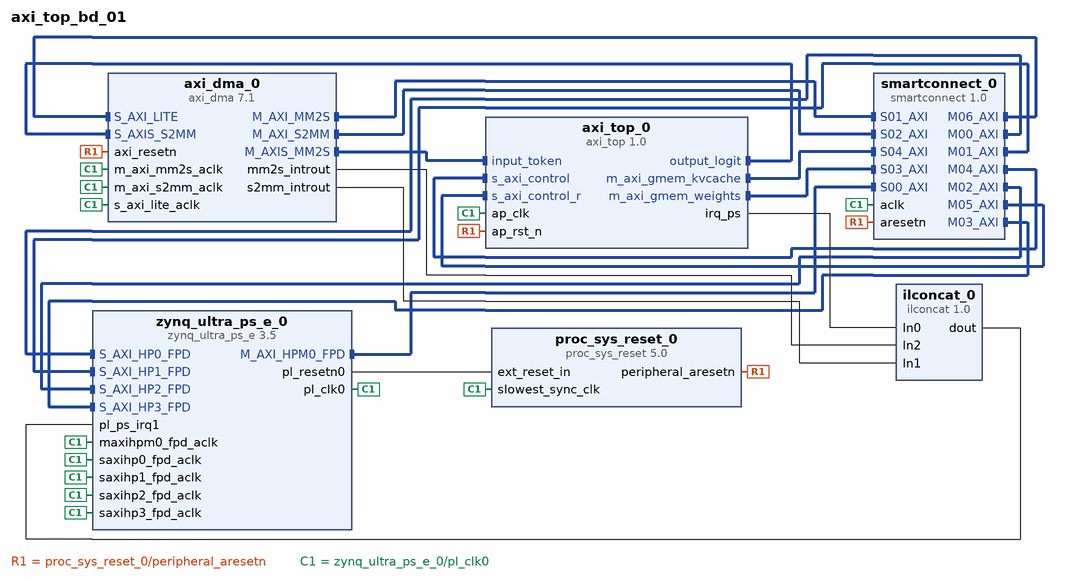
[diagram p0: block diagram of the top level]
# Vivado block design axi_top_bd_01, xck26-sfvc784-2LV-c, Vivado 2025.1
create_bd_design axi_top_bd_01

create_bd_cell -type ip -vlnv xilinx.com:ip:zynq_ultra_ps_e:3.5 zynq_ultra_ps_e_0
set_property -dict [list \
  CONFIG.CAN0_BOARD_INTERFACE custom \
  CONFIG.CAN1_BOARD_INTERFACE custom \
  CONFIG.CSU_BOARD_INTERFACE custom \
  CONFIG.DP_BOARD_INTERFACE custom \
  CONFIG.GEM0_BOARD_INTERFACE custom \
  CONFIG.GEM1_BOARD_INTERFACE custom \
  CONFIG.GEM2_BOARD_INTERFACE custom \
  CONFIG.GEM3_BOARD_INTERFACE custom \
  CONFIG.GPIO_BOARD_INTERFACE custom \
  CONFIG.IIC0_BOARD_INTERFACE custom \
  CONFIG.IIC1_BOARD_INTERFACE custom \
  CONFIG.NAND_BOARD_INTERFACE custom \
  CONFIG.PCIE_BOARD_INTERFACE custom \
  CONFIG.PJTAG_BOARD_INTERFACE custom \
  CONFIG.PMU_BOARD_INTERFACE custom \
  CONFIG.PSU_BANK_0_IO_STANDARD LVCMOS18 \
  CONFIG.PSU_BANK_1_IO_STANDARD LVCMOS18 \
  CONFIG.PSU_BANK_2_IO_STANDARD LVCMOS18 \
  CONFIG.PSU_BANK_3_IO_STANDARD LVCMOS18 \
  CONFIG.PSU_USB3__DUAL_CLOCK_ENABLE 0 \
  CONFIG.PSU__CAN1__PERIPHERAL__ENABLE 0 \
  CONFIG.PSU__CRF_APB__ACPU_CTRL__FREQMHZ 1333.333 \
  CONFIG.PSU__CRF_APB__ACPU_CTRL__SRCSEL APLL \
  CONFIG.PSU__CRF_APB__APLL_CTRL__SRCSEL PSS_REF_CLK \
  CONFIG.PSU__CRF_APB__APLL_FRAC_CFG__ENABLED 1 \
  CONFIG.PSU__CRF_APB__DBG_FPD_CTRL__FREQMHZ 250 \
  CONFIG.PSU__CRF_APB__DBG_FPD_CTRL__SRCSEL IOPLL \
  CONFIG.PSU__CRF_APB__DBG_TRACE_CTRL__FREQMHZ 250 \
  CONFIG.PSU__CRF_APB__DBG_TRACE_CTRL__SRCSEL IOPLL \
  CONFIG.PSU__CRF_APB__DBG_TSTMP_CTRL__FREQMHZ 250 \
  CONFIG.PSU__CRF_APB__DBG_TSTMP_CTRL__SRCSEL IOPLL \
  CONFIG.PSU__CRF_APB__DDR_CTRL__FREQMHZ 1200 \
  CONFIG.PSU__CRF_APB__DDR_CTRL__SRCSEL DPLL \
  CONFIG.PSU__CRF_APB__DPDMA_REF_CTRL__FREQMHZ 600 \
  CONFIG.PSU__CRF_APB__DPDMA_REF_CTRL__SRCSEL APLL \
  CONFIG.PSU__CRF_APB__DPLL_CTRL__SRCSEL PSS_REF_CLK \
  CONFIG.PSU__CRF_APB__DP_AUDIO_REF_CTRL__SRCSEL VPLL \
  CONFIG.PSU__CRF_APB__DP_STC_REF_CTRL__SRCSEL VPLL \
  CONFIG.PSU__CRF_APB__DP_VIDEO_REF_CTRL__SRCSEL DPLL \
  CONFIG.PSU__CRF_APB__GDMA_REF_CTRL__FREQMHZ 600 \
  CONFIG.PSU__CRF_APB__GDMA_REF_CTRL__SRCSEL DPLL \
  CONFIG.PSU__CRF_APB__GPU_REF_CTRL__FREQMHZ 600 \
  CONFIG.PSU__CRF_APB__GPU_REF_CTRL__SRCSEL IOPLL \
  CONFIG.PSU__CRF_APB__TOPSW_LSBUS_CTRL__FREQMHZ 100 \
  CONFIG.PSU__CRF_APB__TOPSW_LSBUS_CTRL__SRCSEL IOPLL \
  CONFIG.PSU__CRF_APB__TOPSW_MAIN_CTRL__FREQMHZ 533.33 \
  CONFIG.PSU__CRF_APB__TOPSW_MAIN_CTRL__SRCSEL DPLL \
  CONFIG.PSU__CRF_APB__VPLL_CTRL__SRCSEL PSS_REF_CLK \
  CONFIG.PSU__CRL_APB__ADMA_REF_CTRL__FREQMHZ 500 \
  CONFIG.PSU__CRL_APB__ADMA_REF_CTRL__SRCSEL IOPLL \
  CONFIG.PSU__CRL_APB__CAN1_REF_CTRL__FREQMHZ 100 \
  CONFIG.PSU__CRL_APB__CAN1_REF_CTRL__SRCSEL IOPLL \
  CONFIG.PSU__CRL_APB__CPU_R5_CTRL__FREQMHZ 533.333 \
  CONFIG.PSU__CRL_APB__CPU_R5_CTRL__SRCSEL RPLL \
  CONFIG.PSU__CRL_APB__DBG_LPD_CTRL__FREQMHZ 250 \
  CONFIG.PSU__CRL_APB__DBG_LPD_CTRL__SRCSEL IOPLL \
  CONFIG.PSU__CRL_APB__GEM3_REF_CTRL__FREQMHZ 125 \
  CONFIG.PSU__CRL_APB__GEM3_REF_CTRL__SRCSEL IOPLL \
  CONFIG.PSU__CRL_APB__I2C0_REF_CTRL__FREQMHZ 100 \
  CONFIG.PSU__CRL_APB__I2C0_REF_CTRL__SRCSEL IOPLL \
  CONFIG.PSU__CRL_APB__I2C1_REF_CTRL__FREQMHZ 100 \
  CONFIG.PSU__CRL_APB__I2C1_REF_CTRL__SRCSEL IOPLL \
  CONFIG.PSU__CRL_APB__IOPLL_CTRL__SRCSEL PSS_REF_CLK \
  CONFIG.PSU__CRL_APB__IOU_SWITCH_CTRL__FREQMHZ 250 \
  CONFIG.PSU__CRL_APB__IOU_SWITCH_CTRL__SRCSEL IOPLL \
  CONFIG.PSU__CRL_APB__LPD_LSBUS_CTRL__FREQMHZ 100 \
  CONFIG.PSU__CRL_APB__LPD_LSBUS_CTRL__SRCSEL IOPLL \
  CONFIG.PSU__CRL_APB__LPD_SWITCH_CTRL__FREQMHZ 500 \
  CONFIG.PSU__CRL_APB__LPD_SWITCH_CTRL__SRCSEL IOPLL \
  CONFIG.PSU__CRL_APB__PCAP_CTRL__FREQMHZ 200 \
  CONFIG.PSU__CRL_APB__PCAP_CTRL__SRCSEL IOPLL \
  CONFIG.PSU__CRL_APB__PL0_REF_CTRL__FREQMHZ 100 \
  CONFIG.PSU__CRL_APB__PL0_REF_CTRL__SRCSEL IOPLL \
  CONFIG.PSU__CRL_APB__PL1_REF_CTRL__SRCSEL IOPLL \
  CONFIG.PSU__CRL_APB__QSPI_REF_CTRL__FREQMHZ 125 \
  CONFIG.PSU__CRL_APB__QSPI_REF_CTRL__SRCSEL IOPLL \
  CONFIG.PSU__CRL_APB__RPLL_CTRL__SRCSEL PSS_REF_CLK \
  CONFIG.PSU__CRL_APB__SDIO1_REF_CTRL__FREQMHZ 200 \
  CONFIG.PSU__CRL_APB__SDIO1_REF_CTRL__SRCSEL RPLL \
  CONFIG.PSU__CRL_APB__SPI1_REF_CTRL__SRCSEL IOPLL \
  CONFIG.PSU__CRL_APB__TIMESTAMP_REF_CTRL__FREQMHZ 100 \
  CONFIG.PSU__CRL_APB__TIMESTAMP_REF_CTRL__SRCSEL IOPLL \
  CONFIG.PSU__CRL_APB__UART0_REF_CTRL__FREQMHZ 100 \
  CONFIG.PSU__CRL_APB__UART0_REF_CTRL__SRCSEL IOPLL \
  CONFIG.PSU__CRL_APB__UART1_REF_CTRL__FREQMHZ 100 \
  CONFIG.PSU__CRL_APB__UART1_REF_CTRL__SRCSEL IOPLL \
  CONFIG.PSU__CRL_APB__USB0_BUS_REF_CTRL__FREQMHZ 250 \
  CONFIG.PSU__CRL_APB__USB0_BUS_REF_CTRL__SRCSEL IOPLL \
  CONFIG.PSU__CRL_APB__USB3_DUAL_REF_CTRL__FREQMHZ 20 \
  CONFIG.PSU__CRL_APB__USB3_DUAL_REF_CTRL__SRCSEL IOPLL \
  CONFIG.PSU__CRL_APB__USB3__ENABLE 0 \
  CONFIG.PSU__CSUPMU__PERIPHERAL__VALID 1 \
  CONFIG.PSU__DDRC__BUS_WIDTH {64 Bit} \
  CONFIG.PSU__DDRC__COMPONENTS Components \
  CONFIG.PSU__DDRC__DEVICE_CAPACITY {8192 MBits} \
  CONFIG.PSU__DDRC__DRAM_WIDTH {16 Bits} \
  CONFIG.PSU__DDRC__ECC Disabled \
  CONFIG.PSU__DDRC__MEMORY_TYPE {DDR 4} \
  CONFIG.PSU__DDRC__SPEED_BIN DDR4_2400R \
  CONFIG.PSU__DDR_HIGH_ADDRESS_GUI_ENABLE 1 \
  CONFIG.PSU__DDR__INTERFACE__FREQMHZ 600.000 \
  CONFIG.PSU__DEVICE_TYPE EV \
  CONFIG.PSU__DISPLAYPORT__PERIPHERAL__ENABLE 0 \
  CONFIG.PSU__DLL__ISUSED 0 \
  CONFIG.PSU__ENET3__PERIPHERAL__ENABLE 0 \
  CONFIG.PSU__FPGA_PL0_ENABLE 1 \
  CONFIG.PSU__FPGA_PL1_ENABLE 1 \
  CONFIG.PSU__GPIO0_MIO__IO {MIO 0 .. 25} \
  CONFIG.PSU__GPIO0_MIO__PERIPHERAL__ENABLE 1 \
  CONFIG.PSU__GPIO1_MIO__IO {MIO 26 .. 51} \
  CONFIG.PSU__GPIO1_MIO__PERIPHERAL__ENABLE 1 \
  CONFIG.PSU__I2C0__PERIPHERAL__ENABLE 0 \
  CONFIG.PSU__I2C1__PERIPHERAL__ENABLE 1 \
  CONFIG.PSU__I2C1__PERIPHERAL__IO {MIO 24 .. 25} \
  CONFIG.PSU__IOU_SLCR__IOU_TTC_APB_CLK__TTC0_SEL APB \
  CONFIG.PSU__IOU_SLCR__IOU_TTC_APB_CLK__TTC1_SEL APB \
  CONFIG.PSU__IOU_SLCR__IOU_TTC_APB_CLK__TTC2_SEL APB \
  CONFIG.PSU__IOU_SLCR__IOU_TTC_APB_CLK__TTC3_SEL APB \
  CONFIG.PSU__MAXIGP0__DATA_WIDTH 128 \
  CONFIG.PSU__OVERRIDE_HPX_QOS 0 \
  CONFIG.PSU__OVERRIDE__BASIC_CLOCK 0 \
  CONFIG.PSU__PMU_COHERENCY 0 \
  CONFIG.PSU__PMU__AIBACK__ENABLE 0 \
  CONFIG.PSU__PMU__EMIO_GPI__ENABLE 0 \
  CONFIG.PSU__PMU__EMIO_GPO__ENABLE 0 \
  CONFIG.PSU__PMU__GPI0__ENABLE 1 \
  CONFIG.PSU__PMU__GPI0__IO {MIO 26} \
  CONFIG.PSU__PMU__GPI1__ENABLE 0 \
  CONFIG.PSU__PMU__GPI2__ENABLE 0 \
  CONFIG.PSU__PMU__GPI3__ENABLE 0 \
  CONFIG.PSU__PMU__GPI4__ENABLE 0 \
  CONFIG.PSU__PMU__GPI5__ENABLE 1 \
  CONFIG.PSU__PMU__GPI5__IO {MIO 31} \
  CONFIG.PSU__PMU__GPO0__ENABLE 0 \
  CONFIG.PSU__PMU__GPO1__ENABLE 0 \
  CONFIG.PSU__PMU__GPO2__ENABLE 0 \
  CONFIG.PSU__PMU__GPO3__ENABLE 1 \
  CONFIG.PSU__PMU__GPO3__IO {MIO 35} \
  CONFIG.PSU__PMU__GPO3__POLARITY low \
  CONFIG.PSU__PMU__GPO4__ENABLE 0 \
  CONFIG.PSU__PMU__GPO5__ENABLE 0 \
  CONFIG.PSU__PMU__PERIPHERAL__ENABLE 1 \
  CONFIG.PSU__PMU__PLERROR__ENABLE 0 \
  CONFIG.PSU__PRESET_APPLIED 1 \
  CONFIG.PSU__PSS_REF_CLK__FREQMHZ 33.333 \
  CONFIG.PSU__QSPI_COHERENCY 0 \
  CONFIG.PSU__QSPI_ROUTE_THROUGH_FPD 0 \
  CONFIG.PSU__QSPI__GRP_FBCLK__ENABLE 0 \
  CONFIG.PSU__QSPI__PERIPHERAL__DATA_MODE x4 \
  CONFIG.PSU__QSPI__PERIPHERAL__ENABLE 1 \
  CONFIG.PSU__QSPI__PERIPHERAL__IO {MIO 0 .. 5} \
  CONFIG.PSU__QSPI__PERIPHERAL__MODE Single \
  CONFIG.PSU__SATA__PERIPHERAL__ENABLE 0 \
  CONFIG.PSU__SD0__CLK_100_SDR_OTAP_DLY 0x3 \
  CONFIG.PSU__SD0__CLK_200_SDR_OTAP_DLY 0x3 \
  CONFIG.PSU__SD0__CLK_50_DDR_ITAP_DLY 0x3D \
  CONFIG.PSU__SD0__CLK_50_DDR_OTAP_DLY 0x4 \
  CONFIG.PSU__SD0__CLK_50_SDR_ITAP_DLY 0x15 \
  CONFIG.PSU__SD0__CLK_50_SDR_OTAP_DLY 0x5 \
  CONFIG.PSU__SD1__CLK_100_SDR_OTAP_DLY 0x3 \
  CONFIG.PSU__SD1__CLK_200_SDR_OTAP_DLY 0x3 \
  CONFIG.PSU__SD1__CLK_50_DDR_ITAP_DLY 0x3D \
  CONFIG.PSU__SD1__CLK_50_DDR_OTAP_DLY 0x4 \
  CONFIG.PSU__SD1__CLK_50_SDR_ITAP_DLY 0x15 \
  CONFIG.PSU__SD1__CLK_50_SDR_OTAP_DLY 0x5 \
  CONFIG.PSU__SD1__PERIPHERAL__ENABLE 0 \
  CONFIG.PSU__SPI1__GRP_SS0__IO {MIO 9} \
  CONFIG.PSU__SPI1__PERIPHERAL__ENABLE 1 \
  CONFIG.PSU__SPI1__PERIPHERAL__IO {MIO 6 .. 11} \
  CONFIG.PSU__SWDT0__CLOCK__ENABLE 0 \
  CONFIG.PSU__SWDT0__PERIPHERAL__ENABLE 1 \
  CONFIG.PSU__SWDT0__RESET__ENABLE 0 \
  CONFIG.PSU__SWDT1__CLOCK__ENABLE 0 \
  CONFIG.PSU__SWDT1__PERIPHERAL__ENABLE 1 \
  CONFIG.PSU__SWDT1__RESET__ENABLE 0 \
  CONFIG.PSU__TTC0__CLOCK__ENABLE 0 \
  CONFIG.PSU__TTC0__PERIPHERAL__ENABLE 1 \
  CONFIG.PSU__TTC0__WAVEOUT__ENABLE 0 \
  CONFIG.PSU__TTC1__CLOCK__ENABLE 0 \
  CONFIG.PSU__TTC1__PERIPHERAL__ENABLE 1 \
  CONFIG.PSU__TTC1__WAVEOUT__ENABLE 0 \
  CONFIG.PSU__TTC2__CLOCK__ENABLE 0 \
  CONFIG.PSU__TTC2__PERIPHERAL__ENABLE 1 \
  CONFIG.PSU__TTC2__WAVEOUT__ENABLE 0 \
  CONFIG.PSU__TTC3__CLOCK__ENABLE 0 \
  CONFIG.PSU__TTC3__PERIPHERAL__ENABLE 1 \
  CONFIG.PSU__TTC3__WAVEOUT__ENABLE 0 \
  CONFIG.PSU__UART0__PERIPHERAL__ENABLE 0 \
  CONFIG.PSU__UART1__PERIPHERAL__ENABLE 0 \
  CONFIG.PSU__USB0__PERIPHERAL__ENABLE 0 \
  CONFIG.PSU__USE__IRQ0 0 \
  CONFIG.PSU__USE__IRQ1 1 \
  CONFIG.PSU__USE__M_AXI_GP0 1 \
  CONFIG.PSU__USE__M_AXI_GP1 0 \
  CONFIG.PSU__USE__M_AXI_GP2 0 \
  CONFIG.PSU__USE__S_AXI_GP2 1 \
  CONFIG.PSU__USE__S_AXI_GP3 1 \
  CONFIG.PSU__USE__S_AXI_GP4 1 \
  CONFIG.PSU__USE__S_AXI_GP5 1 \
  CONFIG.QSPI_BOARD_INTERFACE custom \
  CONFIG.SATA_BOARD_INTERFACE custom \
  CONFIG.SD0_BOARD_INTERFACE custom \
  CONFIG.SD1_BOARD_INTERFACE custom \
  CONFIG.SPI0_BOARD_INTERFACE custom \
  CONFIG.SPI1_BOARD_INTERFACE custom \
  CONFIG.SUBPRESET1 Custom \
  CONFIG.SUBPRESET2 Custom \
  CONFIG.SWDT0_BOARD_INTERFACE custom \
  CONFIG.SWDT1_BOARD_INTERFACE custom \
  CONFIG.TRACE_BOARD_INTERFACE custom \
  CONFIG.TTC0_BOARD_INTERFACE custom \
  CONFIG.TTC1_BOARD_INTERFACE custom \
  CONFIG.TTC2_BOARD_INTERFACE custom \
  CONFIG.TTC3_BOARD_INTERFACE custom \
  CONFIG.UART0_BOARD_INTERFACE custom \
  CONFIG.UART1_BOARD_INTERFACE custom \
  CONFIG.USB0_BOARD_INTERFACE custom \
  CONFIG.USB1_BOARD_INTERFACE custom \
  CONFIG.preset None \
] [get_bd_cells zynq_ultra_ps_e_0]
# 778 more settings of zynq_ultra_ps_e_0 are not shown: defaults, MIO pin electricals, DDR timing, and values the tool derives
create_bd_cell -type ip -vlnv xilinx.com:ip:proc_sys_reset:5.0 proc_sys_reset_0
create_bd_cell -type ip -vlnv xilinx.com:ip:smartconnect:1.0 smartconnect_0
set_property -dict {CONFIG.NUM_MI 7 CONFIG.NUM_SI 5} [get_bd_cells smartconnect_0]
create_bd_cell -type inline_hdl -vlnv xilinx.com:inline_hdl:ilconcat:1.0 ilconcat_0
set_property -dict {CONFIG.NUM_PORTS 3} [get_bd_cells ilconcat_0]
create_bd_cell -type ip -vlnv xilinx.com:ip:axi_dma:7.1 axi_dma_0
set_property -dict [list \
  CONFIG.c_addr_width 64 \
  CONFIG.c_include_mm2s 1 \
  CONFIG.c_include_s2mm 1 \
  CONFIG.c_include_sg 0 \
  CONFIG.c_m_axis_mm2s_tdata_width 512 \
  CONFIG.c_s2mm_burst_size 2 \
  CONFIG.c_s_axis_s2mm_tdata_width 512 \
] [get_bd_cells axi_dma_0]
create_bd_cell -type ip -vlnv xilinx.com:hls:axi_top:1.0 axi_top_0

# ---- connections ----

connect_bd_intf_net [get_bd_intf_pins axi_top_0/input_token] [get_bd_intf_pins axi_dma_0/M_AXIS_MM2S]
connect_bd_intf_net [get_bd_intf_pins axi_dma_0/M_AXI_MM2S] [get_bd_intf_pins smartconnect_0/S01_AXI]
connect_bd_intf_net [get_bd_intf_pins axi_dma_0/M_AXI_S2MM] [get_bd_intf_pins smartconnect_0/S02_AXI]
connect_bd_intf_net [get_bd_intf_pins axi_top_0/m_axi_gmem_kvcache] [get_bd_intf_pins smartconnect_0/S04_AXI]
connect_bd_intf_net [get_bd_intf_pins axi_top_0/m_axi_gmem_weights] [get_bd_intf_pins smartconnect_0/S03_AXI]
connect_bd_intf_net [get_bd_intf_pins axi_top_0/output_logit] [get_bd_intf_pins axi_dma_0/S_AXIS_S2MM]
connect_bd_intf_net [get_bd_intf_pins zynq_ultra_ps_e_0/S_AXI_HP0_FPD] [get_bd_intf_pins smartconnect_0/M00_AXI]
connect_bd_intf_net [get_bd_intf_pins zynq_ultra_ps_e_0/S_AXI_HP1_FPD] [get_bd_intf_pins smartconnect_0/M01_AXI]
connect_bd_intf_net [get_bd_intf_pins zynq_ultra_ps_e_0/S_AXI_HP2_FPD] [get_bd_intf_pins smartconnect_0/M02_AXI]
connect_bd_intf_net [get_bd_intf_pins zynq_ultra_ps_e_0/S_AXI_HP3_FPD] [get_bd_intf_pins smartconnect_0/M03_AXI]
connect_bd_intf_net [get_bd_intf_pins axi_top_0/s_axi_control] [get_bd_intf_pins smartconnect_0/M04_AXI]
connect_bd_intf_net [get_bd_intf_pins axi_top_0/s_axi_control_r] [get_bd_intf_pins smartconnect_0/M05_AXI]
connect_bd_intf_net [get_bd_intf_pins axi_dma_0/S_AXI_LITE] [get_bd_intf_pins smartconnect_0/M06_AXI]
connect_bd_intf_net [get_bd_intf_pins zynq_ultra_ps_e_0/M_AXI_HPM0_FPD] [get_bd_intf_pins smartconnect_0/S00_AXI]
connect_bd_net [get_bd_pins axi_dma_0/mm2s_introut] [get_bd_pins ilconcat_0/In2]
connect_bd_net [get_bd_pins axi_dma_0/s2mm_introut] [get_bd_pins ilconcat_0/In1]
connect_bd_net [get_bd_pins axi_top_0/irq_ps] [get_bd_pins ilconcat_0/In0]
connect_bd_net [get_bd_pins ilconcat_0/dout] [get_bd_pins zynq_ultra_ps_e_0/pl_ps_irq1]
connect_bd_net [get_bd_pins proc_sys_reset_0/peripheral_aresetn] \
  [get_bd_pins smartconnect_0/aresetn] [get_bd_pins axi_dma_0/axi_resetn] [get_bd_pins axi_top_0/ap_rst_n]
connect_bd_net [get_bd_pins zynq_ultra_ps_e_0/pl_clk0] \
  [get_bd_pins smartconnect_0/aclk] [get_bd_pins proc_sys_reset_0/slowest_sync_clk] [get_bd_pins axi_dma_0/m_axi_mm2s_aclk] \
  [get_bd_pins axi_dma_0/m_axi_s2mm_aclk] [get_bd_pins axi_dma_0/s_axi_lite_aclk] \
  [get_bd_pins zynq_ultra_ps_e_0/saxihp0_fpd_aclk] [get_bd_pins zynq_ultra_ps_e_0/maxihpm0_fpd_aclk] \
  [get_bd_pins zynq_ultra_ps_e_0/saxihp1_fpd_aclk] [get_bd_pins zynq_ultra_ps_e_0/saxihp2_fpd_aclk] \
  [get_bd_pins zynq_ultra_ps_e_0/saxihp3_fpd_aclk] [get_bd_pins axi_top_0/ap_clk]
connect_bd_net [get_bd_pins zynq_ultra_ps_e_0/pl_resetn0] [get_bd_pins proc_sys_reset_0/ext_reset_in]

# ---- address map ----
assign_bd_address -offset 0x0000000000000000 -range 2G -target_address_space [get_bd_addr_spaces axi_dma_0/Data_MM2S] [get_bd_addr_segs zynq_ultra_ps_e_0/SAXIGP4/HP2_DDR_LOW]
exclude_bd_addr_seg -offset 0x0000000000000000 -range 1 -target_address_space [get_bd_addr_spaces axi_dma_0/Data_MM2S] [get_bd_addr_segs axi_dma_0/S_AXI_LITE/Reg]
exclude_bd_addr_seg -offset 0x0000000000000000 -range 1 -target_address_space [get_bd_addr_spaces axi_dma_0/Data_MM2S] [get_bd_addr_segs axi_top_0/s_axi_control/Reg]
exclude_bd_addr_seg -offset 0x0000000000000000 -range 1 -target_address_space [get_bd_addr_spaces axi_dma_0/Data_MM2S] [get_bd_addr_segs axi_top_0/s_axi_control_r/Reg]
exclude_bd_addr_seg -offset 0x0000000000000000 -range 1 -target_address_space [get_bd_addr_spaces axi_dma_0/Data_MM2S] [get_bd_addr_segs zynq_ultra_ps_e_0/SAXIGP2/HP0_DDR_HIGH]
exclude_bd_addr_seg -offset 0x0000000000000000 -range 1 -target_address_space [get_bd_addr_spaces axi_dma_0/Data_MM2S] [get_bd_addr_segs zynq_ultra_ps_e_0/SAXIGP2/HP0_DDR_LOW]
exclude_bd_addr_seg -offset 0x0000000000000000 -range 1 -target_address_space [get_bd_addr_spaces axi_dma_0/Data_MM2S] [get_bd_addr_segs zynq_ultra_ps_e_0/SAXIGP2/HP0_LPS_OCM]
exclude_bd_addr_seg -offset 0x0000000000000000 -range 1 -target_address_space [get_bd_addr_spaces axi_dma_0/Data_MM2S] [get_bd_addr_segs zynq_ultra_ps_e_0/SAXIGP2/HP0_QSPI]
exclude_bd_addr_seg -offset 0x0000000000000000 -range 1 -target_address_space [get_bd_addr_spaces axi_dma_0/Data_MM2S] [get_bd_addr_segs zynq_ultra_ps_e_0/SAXIGP3/HP1_DDR_HIGH]
exclude_bd_addr_seg -offset 0x0000000000000000 -range 1 -target_address_space [get_bd_addr_spaces axi_dma_0/Data_MM2S] [get_bd_addr_segs zynq_ultra_ps_e_0/SAXIGP3/HP1_DDR_LOW]
exclude_bd_addr_seg -offset 0x0000000000000000 -range 1 -target_address_space [get_bd_addr_spaces axi_dma_0/Data_MM2S] [get_bd_addr_segs zynq_ultra_ps_e_0/SAXIGP3/HP1_LPS_OCM]
exclude_bd_addr_seg -offset 0x0000000000000000 -range 1 -target_address_space [get_bd_addr_spaces axi_dma_0/Data_MM2S] [get_bd_addr_segs zynq_ultra_ps_e_0/SAXIGP3/HP1_QSPI]
exclude_bd_addr_seg -offset 0x0000000000000000 -range 1 -target_address_space [get_bd_addr_spaces axi_dma_0/Data_MM2S] [get_bd_addr_segs zynq_ultra_ps_e_0/SAXIGP4/HP2_DDR_HIGH]
exclude_bd_addr_seg -offset 0x0000000000000000 -range 1 -target_address_space [get_bd_addr_spaces axi_dma_0/Data_MM2S] [get_bd_addr_segs zynq_ultra_ps_e_0/SAXIGP4/HP2_LPS_OCM]
exclude_bd_addr_seg -offset 0x0000000000000000 -range 1 -target_address_space [get_bd_addr_spaces axi_dma_0/Data_MM2S] [get_bd_addr_segs zynq_ultra_ps_e_0/SAXIGP4/HP2_QSPI]
exclude_bd_addr_seg -offset 0x0000000000000000 -range 1 -target_address_space [get_bd_addr_spaces axi_dma_0/Data_MM2S] [get_bd_addr_segs zynq_ultra_ps_e_0/SAXIGP5/HP3_DDR_HIGH]
exclude_bd_addr_seg -offset 0x0000000000000000 -range 1 -target_address_space [get_bd_addr_spaces axi_dma_0/Data_MM2S] [get_bd_addr_segs zynq_ultra_ps_e_0/SAXIGP5/HP3_DDR_LOW]
exclude_bd_addr_seg -offset 0x0000000000000000 -range 1 -target_address_space [get_bd_addr_spaces axi_dma_0/Data_MM2S] [get_bd_addr_segs zynq_ultra_ps_e_0/SAXIGP5/HP3_LPS_OCM]
exclude_bd_addr_seg -offset 0x0000000000000000 -range 1 -target_address_space [get_bd_addr_spaces axi_dma_0/Data_MM2S] [get_bd_addr_segs zynq_ultra_ps_e_0/SAXIGP5/HP3_QSPI]
assign_bd_address -offset 0x0000000000000000 -range 2G -target_address_space [get_bd_addr_spaces axi_dma_0/Data_S2MM] [get_bd_addr_segs zynq_ultra_ps_e_0/SAXIGP5/HP3_DDR_LOW]
exclude_bd_addr_seg -offset 0x0000000000000000 -range 1 -target_address_space [get_bd_addr_spaces axi_dma_0/Data_S2MM] [get_bd_addr_segs axi_dma_0/S_AXI_LITE/Reg]
exclude_bd_addr_seg -offset 0x0000000000000000 -range 1 -target_address_space [get_bd_addr_spaces axi_dma_0/Data_S2MM] [get_bd_addr_segs axi_top_0/s_axi_control/Reg]
exclude_bd_addr_seg -offset 0x0000000000000000 -range 1 -target_address_space [get_bd_addr_spaces axi_dma_0/Data_S2MM] [get_bd_addr_segs axi_top_0/s_axi_control_r/Reg]
exclude_bd_addr_seg -offset 0x0000000000000000 -range 1 -target_address_space [get_bd_addr_spaces axi_dma_0/Data_S2MM] [get_bd_addr_segs zynq_ultra_ps_e_0/SAXIGP2/HP0_DDR_HIGH]
exclude_bd_addr_seg -offset 0x0000000000000000 -range 1 -target_address_space [get_bd_addr_spaces axi_dma_0/Data_S2MM] [get_bd_addr_segs zynq_ultra_ps_e_0/SAXIGP2/HP0_DDR_LOW]
exclude_bd_addr_seg -offset 0x0000000000000000 -range 1 -target_address_space [get_bd_addr_spaces axi_dma_0/Data_S2MM] [get_bd_addr_segs zynq_ultra_ps_e_0/SAXIGP2/HP0_LPS_OCM]
exclude_bd_addr_seg -offset 0x0000000000000000 -range 1 -target_address_space [get_bd_addr_spaces axi_dma_0/Data_S2MM] [get_bd_addr_segs zynq_ultra_ps_e_0/SAXIGP2/HP0_QSPI]
exclude_bd_addr_seg -offset 0x0000000000000000 -range 1 -target_address_space [get_bd_addr_spaces axi_dma_0/Data_S2MM] [get_bd_addr_segs zynq_ultra_ps_e_0/SAXIGP3/HP1_DDR_HIGH]
exclude_bd_addr_seg -offset 0x0000000000000000 -range 1 -target_address_space [get_bd_addr_spaces axi_dma_0/Data_S2MM] [get_bd_addr_segs zynq_ultra_ps_e_0/SAXIGP3/HP1_DDR_LOW]
exclude_bd_addr_seg -offset 0x0000000000000000 -range 1 -target_address_space [get_bd_addr_spaces axi_dma_0/Data_S2MM] [get_bd_addr_segs zynq_ultra_ps_e_0/SAXIGP3/HP1_LPS_OCM]
exclude_bd_addr_seg -offset 0x0000000000000000 -range 1 -target_address_space [get_bd_addr_spaces axi_dma_0/Data_S2MM] [get_bd_addr_segs zynq_ultra_ps_e_0/SAXIGP3/HP1_QSPI]
exclude_bd_addr_seg -offset 0x0000000000000000 -range 1 -target_address_space [get_bd_addr_spaces axi_dma_0/Data_S2MM] [get_bd_addr_segs zynq_ultra_ps_e_0/SAXIGP4/HP2_DDR_HIGH]
exclude_bd_addr_seg -offset 0x0000000000000000 -range 1 -target_address_space [get_bd_addr_spaces axi_dma_0/Data_S2MM] [get_bd_addr_segs zynq_ultra_ps_e_0/SAXIGP4/HP2_DDR_LOW]
exclude_bd_addr_seg -offset 0x0000000000000000 -range 1 -target_address_space [get_bd_addr_spaces axi_dma_0/Data_S2MM] [get_bd_addr_segs zynq_ultra_ps_e_0/SAXIGP4/HP2_LPS_OCM]
exclude_bd_addr_seg -offset 0x0000000000000000 -range 1 -target_address_space [get_bd_addr_spaces axi_dma_0/Data_S2MM] [get_bd_addr_segs zynq_ultra_ps_e_0/SAXIGP4/HP2_QSPI]
exclude_bd_addr_seg -offset 0x0000000000000000 -range 1 -target_address_space [get_bd_addr_spaces axi_dma_0/Data_S2MM] [get_bd_addr_segs zynq_ultra_ps_e_0/SAXIGP5/HP3_DDR_HIGH]
exclude_bd_addr_seg -offset 0x0000000000000000 -range 1 -target_address_space [get_bd_addr_spaces axi_dma_0/Data_S2MM] [get_bd_addr_segs zynq_ultra_ps_e_0/SAXIGP5/HP3_LPS_OCM]
exclude_bd_addr_seg -offset 0x0000000000000000 -range 1 -target_address_space [get_bd_addr_spaces axi_dma_0/Data_S2MM] [get_bd_addr_segs zynq_ultra_ps_e_0/SAXIGP5/HP3_QSPI]
assign_bd_address -offset 0x0000000000000000 -range 2G -target_address_space [get_bd_addr_spaces axi_top_0/Data_m_axi_gmem_kvcache] [get_bd_addr_segs zynq_ultra_ps_e_0/SAXIGP3/HP1_DDR_LOW]
exclude_bd_addr_seg -offset 0x0000000000000000 -range 1 -target_address_space [get_bd_addr_spaces axi_top_0/Data_m_axi_gmem_kvcache] [get_bd_addr_segs axi_dma_0/S_AXI_LITE/Reg]
exclude_bd_addr_seg -offset 0x0000000000000000 -range 1 -target_address_space [get_bd_addr_spaces axi_top_0/Data_m_axi_gmem_kvcache] [get_bd_addr_segs axi_top_0/s_axi_control/Reg]
exclude_bd_addr_seg -offset 0x0000000000000000 -range 1 -target_address_space [get_bd_addr_spaces axi_top_0/Data_m_axi_gmem_kvcache] [get_bd_addr_segs axi_top_0/s_axi_control_r/Reg]
exclude_bd_addr_seg -offset 0x0000000000000000 -range 1 -target_address_space [get_bd_addr_spaces axi_top_0/Data_m_axi_gmem_kvcache] [get_bd_addr_segs zynq_ultra_ps_e_0/SAXIGP2/HP0_DDR_HIGH]
exclude_bd_addr_seg -offset 0x0000000000000000 -range 1 -target_address_space [get_bd_addr_spaces axi_top_0/Data_m_axi_gmem_kvcache] [get_bd_addr_segs zynq_ultra_ps_e_0/SAXIGP2/HP0_DDR_LOW]
exclude_bd_addr_seg -offset 0x0000000000000000 -range 1 -target_address_space [get_bd_addr_spaces axi_top_0/Data_m_axi_gmem_kvcache] [get_bd_addr_segs zynq_ultra_ps_e_0/SAXIGP2/HP0_LPS_OCM]
exclude_bd_addr_seg -offset 0x0000000000000000 -range 1 -target_address_space [get_bd_addr_spaces axi_top_0/Data_m_axi_gmem_kvcache] [get_bd_addr_segs zynq_ultra_ps_e_0/SAXIGP2/HP0_QSPI]
exclude_bd_addr_seg -offset 0x0000000000000000 -range 1 -target_address_space [get_bd_addr_spaces axi_top_0/Data_m_axi_gmem_kvcache] [get_bd_addr_segs zynq_ultra_ps_e_0/SAXIGP3/HP1_DDR_HIGH]
exclude_bd_addr_seg -offset 0x0000000000000000 -range 1 -target_address_space [get_bd_addr_spaces axi_top_0/Data_m_axi_gmem_kvcache] [get_bd_addr_segs zynq_ultra_ps_e_0/SAXIGP3/HP1_LPS_OCM]
exclude_bd_addr_seg -offset 0x0000000000000000 -range 1 -target_address_space [get_bd_addr_spaces axi_top_0/Data_m_axi_gmem_kvcache] [get_bd_addr_segs zynq_ultra_ps_e_0/SAXIGP3/HP1_QSPI]
exclude_bd_addr_seg -offset 0x0000000000000000 -range 1 -target_address_space [get_bd_addr_spaces axi_top_0/Data_m_axi_gmem_kvcache] [get_bd_addr_segs zynq_ultra_ps_e_0/SAXIGP4/HP2_DDR_HIGH]
exclude_bd_addr_seg -offset 0x0000000000000000 -range 1 -target_address_space [get_bd_addr_spaces axi_top_0/Data_m_axi_gmem_kvcache] [get_bd_addr_segs zynq_ultra_ps_e_0/SAXIGP4/HP2_DDR_LOW]
exclude_bd_addr_seg -offset 0x0000000000000000 -range 1 -target_address_space [get_bd_addr_spaces axi_top_0/Data_m_axi_gmem_kvcache] [get_bd_addr_segs zynq_ultra_ps_e_0/SAXIGP4/HP2_LPS_OCM]
exclude_bd_addr_seg -offset 0x0000000000000000 -range 1 -target_address_space [get_bd_addr_spaces axi_top_0/Data_m_axi_gmem_kvcache] [get_bd_addr_segs zynq_ultra_ps_e_0/SAXIGP4/HP2_QSPI]
exclude_bd_addr_seg -offset 0x0000000000000000 -range 1 -target_address_space [get_bd_addr_spaces axi_top_0/Data_m_axi_gmem_kvcache] [get_bd_addr_segs zynq_ultra_ps_e_0/SAXIGP5/HP3_DDR_HIGH]
exclude_bd_addr_seg -offset 0x0000000000000000 -range 1 -target_address_space [get_bd_addr_spaces axi_top_0/Data_m_axi_gmem_kvcache] [get_bd_addr_segs zynq_ultra_ps_e_0/SAXIGP5/HP3_DDR_LOW]
exclude_bd_addr_seg -offset 0x0000000000000000 -range 1 -target_address_space [get_bd_addr_spaces axi_top_0/Data_m_axi_gmem_kvcache] [get_bd_addr_segs zynq_ultra_ps_e_0/SAXIGP5/HP3_LPS_OCM]
exclude_bd_addr_seg -offset 0x0000000000000000 -range 1 -target_address_space [get_bd_addr_spaces axi_top_0/Data_m_axi_gmem_kvcache] [get_bd_addr_segs zynq_ultra_ps_e_0/SAXIGP5/HP3_QSPI]
assign_bd_address -offset 0x0000000800000000 -range 2G -target_address_space [get_bd_addr_spaces axi_top_0/Data_m_axi_gmem_weights] [get_bd_addr_segs zynq_ultra_ps_e_0/SAXIGP2/HP0_DDR_HIGH]
exclude_bd_addr_seg -offset 0x0000000000000000 -range 1 -target_address_space [get_bd_addr_spaces axi_top_0/Data_m_axi_gmem_weights] [get_bd_addr_segs axi_dma_0/S_AXI_LITE/Reg]
exclude_bd_addr_seg -offset 0x0000000000000000 -range 1 -target_address_space [get_bd_addr_spaces axi_top_0/Data_m_axi_gmem_weights] [get_bd_addr_segs axi_top_0/s_axi_control/Reg]
exclude_bd_addr_seg -offset 0x0000000000000000 -range 1 -target_address_space [get_bd_addr_spaces axi_top_0/Data_m_axi_gmem_weights] [get_bd_addr_segs axi_top_0/s_axi_control_r/Reg]
exclude_bd_addr_seg -offset 0x0000000000000000 -range 1 -target_address_space [get_bd_addr_spaces axi_top_0/Data_m_axi_gmem_weights] [get_bd_addr_segs zynq_ultra_ps_e_0/SAXIGP2/HP0_DDR_LOW]
exclude_bd_addr_seg -offset 0x0000000000000000 -range 1 -target_address_space [get_bd_addr_spaces axi_top_0/Data_m_axi_gmem_weights] [get_bd_addr_segs zynq_ultra_ps_e_0/SAXIGP2/HP0_LPS_OCM]
exclude_bd_addr_seg -offset 0x0000000000000000 -range 1 -target_address_space [get_bd_addr_spaces axi_top_0/Data_m_axi_gmem_weights] [get_bd_addr_segs zynq_ultra_ps_e_0/SAXIGP2/HP0_QSPI]
exclude_bd_addr_seg -offset 0x0000000000000000 -range 1 -target_address_space [get_bd_addr_spaces axi_top_0/Data_m_axi_gmem_weights] [get_bd_addr_segs zynq_ultra_ps_e_0/SAXIGP3/HP1_DDR_HIGH]
exclude_bd_addr_seg -offset 0x0000000000000000 -range 1 -target_address_space [get_bd_addr_spaces axi_top_0/Data_m_axi_gmem_weights] [get_bd_addr_segs zynq_ultra_ps_e_0/SAXIGP3/HP1_DDR_LOW]
exclude_bd_addr_seg -offset 0x0000000000000000 -range 1 -target_address_space [get_bd_addr_spaces axi_top_0/Data_m_axi_gmem_weights] [get_bd_addr_segs zynq_ultra_ps_e_0/SAXIGP3/HP1_LPS_OCM]
exclude_bd_addr_seg -offset 0x0000000000000000 -range 1 -target_address_space [get_bd_addr_spaces axi_top_0/Data_m_axi_gmem_weights] [get_bd_addr_segs zynq_ultra_ps_e_0/SAXIGP3/HP1_QSPI]
exclude_bd_addr_seg -offset 0x0000000000000000 -range 1 -target_address_space [get_bd_addr_spaces axi_top_0/Data_m_axi_gmem_weights] [get_bd_addr_segs zynq_ultra_ps_e_0/SAXIGP4/HP2_DDR_HIGH]
exclude_bd_addr_seg -offset 0x0000000000000000 -range 1 -target_address_space [get_bd_addr_spaces axi_top_0/Data_m_axi_gmem_weights] [get_bd_addr_segs zynq_ultra_ps_e_0/SAXIGP4/HP2_DDR_LOW]
exclude_bd_addr_seg -offset 0x0000000000000000 -range 1 -target_address_space [get_bd_addr_spaces axi_top_0/Data_m_axi_gmem_weights] [get_bd_addr_segs zynq_ultra_ps_e_0/SAXIGP4/HP2_LPS_OCM]
exclude_bd_addr_seg -offset 0x0000000000000000 -range 1 -target_address_space [get_bd_addr_spaces axi_top_0/Data_m_axi_gmem_weights] [get_bd_addr_segs zynq_ultra_ps_e_0/SAXIGP4/HP2_QSPI]
exclude_bd_addr_seg -offset 0x0000000000000000 -range 1 -target_address_space [get_bd_addr_spaces axi_top_0/Data_m_axi_gmem_weights] [get_bd_addr_segs zynq_ultra_ps_e_0/SAXIGP5/HP3_DDR_HIGH]
exclude_bd_addr_seg -offset 0x0000000000000000 -range 1 -target_address_space [get_bd_addr_spaces axi_top_0/Data_m_axi_gmem_weights] [get_bd_addr_segs zynq_ultra_ps_e_0/SAXIGP5/HP3_DDR_LOW]
exclude_bd_addr_seg -offset 0x0000000000000000 -range 1 -target_address_space [get_bd_addr_spaces axi_top_0/Data_m_axi_gmem_weights] [get_bd_addr_segs zynq_ultra_ps_e_0/SAXIGP5/HP3_LPS_OCM]
exclude_bd_addr_seg -offset 0x0000000000000000 -range 1 -target_address_space [get_bd_addr_spaces axi_top_0/Data_m_axi_gmem_weights] [get_bd_addr_segs zynq_ultra_ps_e_0/SAXIGP5/HP3_QSPI]
assign_bd_address -offset 0x00A0000000 -range 64K -target_address_space [get_bd_addr_spaces zynq_ultra_ps_e_0/Data] [get_bd_addr_segs axi_dma_0/S_AXI_LITE/Reg]
assign_bd_address -offset 0x00A0010000 -range 64K -target_address_space [get_bd_addr_spaces zynq_ultra_ps_e_0/Data] [get_bd_addr_segs axi_top_0/s_axi_control/Reg]
assign_bd_address -offset 0x00A0020000 -range 64K -target_address_space [get_bd_addr_spaces zynq_ultra_ps_e_0/Data] [get_bd_addr_segs axi_top_0/s_axi_control_r/Reg]
exclude_bd_addr_seg -offset 0x0080000000 -range 1 -target_address_space [get_bd_addr_spaces zynq_ultra_ps_e_0/Data] [get_bd_addr_segs zynq_ultra_ps_e_0/SAXIGP2/HP0_DDR_HIGH]
exclude_bd_addr_seg -offset 0x0080000000 -range 1 -target_address_space [get_bd_addr_spaces zynq_ultra_ps_e_0/Data] [get_bd_addr_segs zynq_ultra_ps_e_0/SAXIGP2/HP0_DDR_LOW]
exclude_bd_addr_seg -offset 0x0080000000 -range 1 -target_address_space [get_bd_addr_spaces zynq_ultra_ps_e_0/Data] [get_bd_addr_segs zynq_ultra_ps_e_0/SAXIGP2/HP0_LPS_OCM]
exclude_bd_addr_seg -offset 0x0080000000 -range 1 -target_address_space [get_bd_addr_spaces zynq_ultra_ps_e_0/Data] [get_bd_addr_segs zynq_ultra_ps_e_0/SAXIGP2/HP0_QSPI]
exclude_bd_addr_seg -offset 0x0080000000 -range 1 -target_address_space [get_bd_addr_spaces zynq_ultra_ps_e_0/Data] [get_bd_addr_segs zynq_ultra_ps_e_0/SAXIGP3/HP1_DDR_HIGH]
exclude_bd_addr_seg -offset 0x0080000000 -range 1 -target_address_space [get_bd_addr_spaces zynq_ultra_ps_e_0/Data] [get_bd_addr_segs zynq_ultra_ps_e_0/SAXIGP3/HP1_DDR_LOW]
exclude_bd_addr_seg -offset 0x0080000000 -range 1 -target_address_space [get_bd_addr_spaces zynq_ultra_ps_e_0/Data] [get_bd_addr_segs zynq_ultra_ps_e_0/SAXIGP3/HP1_LPS_OCM]
exclude_bd_addr_seg -offset 0x0080000000 -range 1 -target_address_space [get_bd_addr_spaces zynq_ultra_ps_e_0/Data] [get_bd_addr_segs zynq_ultra_ps_e_0/SAXIGP3/HP1_QSPI]
exclude_bd_addr_seg -offset 0x0080000000 -range 1 -target_address_space [get_bd_addr_spaces zynq_ultra_ps_e_0/Data] [get_bd_addr_segs zynq_ultra_ps_e_0/SAXIGP4/HP2_DDR_HIGH]
exclude_bd_addr_seg -offset 0x0080000000 -range 1 -target_address_space [get_bd_addr_spaces zynq_ultra_ps_e_0/Data] [get_bd_addr_segs zynq_ultra_ps_e_0/SAXIGP4/HP2_DDR_LOW]
exclude_bd_addr_seg -offset 0x0080000000 -range 1 -target_address_space [get_bd_addr_spaces zynq_ultra_ps_e_0/Data] [get_bd_addr_segs zynq_ultra_ps_e_0/SAXIGP4/HP2_LPS_OCM]
exclude_bd_addr_seg -offset 0x0080000000 -range 1 -target_address_space [get_bd_addr_spaces zynq_ultra_ps_e_0/Data] [get_bd_addr_segs zynq_ultra_ps_e_0/SAXIGP4/HP2_QSPI]
exclude_bd_addr_seg -offset 0x0080000000 -range 1 -target_address_space [get_bd_addr_spaces zynq_ultra_ps_e_0/Data] [get_bd_addr_segs zynq_ultra_ps_e_0/SAXIGP5/HP3_DDR_HIGH]
exclude_bd_addr_seg -offset 0x0080000000 -range 1 -target_address_space [get_bd_addr_spaces zynq_ultra_ps_e_0/Data] [get_bd_addr_segs zynq_ultra_ps_e_0/SAXIGP5/HP3_DDR_LOW]
exclude_bd_addr_seg -offset 0x0080000000 -range 1 -target_address_space [get_bd_addr_spaces zynq_ultra_ps_e_0/Data] [get_bd_addr_segs zynq_ultra_ps_e_0/SAXIGP5/HP3_LPS_OCM]
exclude_bd_addr_seg -offset 0x0080000000 -range 1 -target_address_space [get_bd_addr_spaces zynq_ultra_ps_e_0/Data] [get_bd_addr_segs zynq_ultra_ps_e_0/SAXIGP5/HP3_QSPI]

validate_bd_design
save_bd_design
